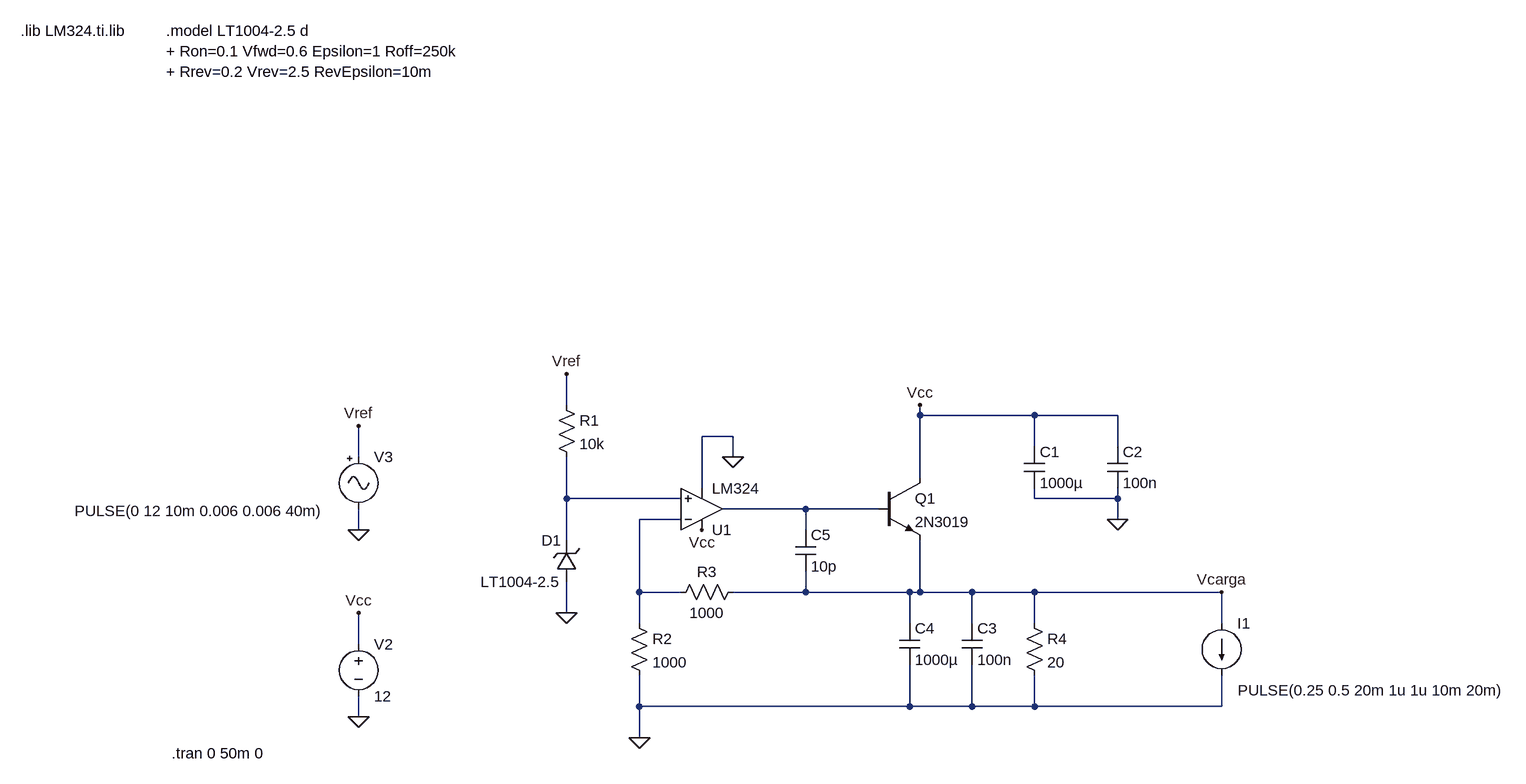
[diagram p0: schematic fuente.asc]
fuente.asc, the LTspice schematic file:
Version 4.1
SHEET 1 1676 680
WIRE 96 64 96 16
WIRE 640 80 640 64
WIRE 816 80 640 80
WIRE 944 80 816 80
WIRE 352 112 304 112
WIRE 816 128 816 80
WIRE 944 128 944 80
WIRE -224 144 -224 96
WIRE 352 144 352 112
WIRE 640 176 640 80
WIRE 304 192 304 112
WIRE 96 208 96 144
WIRE 272 208 96 208
WIRE 816 208 816 192
WIRE 944 208 944 192
WIRE 944 208 816 208
WIRE 464 224 336 224
WIRE 576 224 464 224
WIRE 272 240 208 240
WIRE 944 240 944 208
WIRE -224 256 -224 224
WIRE 464 256 464 224
WIRE 96 272 96 208
WIRE 208 352 208 240
WIRE 272 352 208 352
WIRE 464 352 464 320
WIRE 464 352 352 352
WIRE 624 352 464 352
WIRE 640 352 640 272
WIRE 640 352 624 352
WIRE 720 352 640 352
WIRE 816 352 720 352
WIRE 1104 352 816 352
WIRE 96 384 96 336
WIRE 208 400 208 352
WIRE 624 400 624 352
WIRE 720 400 720 352
WIRE 816 400 816 352
WIRE 1104 400 1104 352
WIRE -224 432 -224 384
WIRE 208 528 208 480
WIRE 624 528 624 464
WIRE 624 528 208 528
WIRE 720 528 720 464
WIRE 720 528 624 528
WIRE 816 528 816 480
WIRE 816 528 720 528
WIRE 1104 528 1104 480
WIRE 1104 528 816 528
WIRE -224 544 -224 512
WIRE 208 576 208 528
FLAG 96 384 0
FLAG 208 576 0
FLAG -224 384 Vcc
FLAG 304 256 Vcc
FLAG -224 544 0
FLAG 352 144 0
FLAG 640 64 Vcc
FLAG 96 16 Vref
FLAG -224 256 0
FLAG -224 96 Vref
FLAG 1104 352 Vcarga
FLAG 944 240 0
SYMBOL OpAmps\\opamp2 304 288 M180
SYMATTR InstName U1
SYMATTR Value LM324
SYMBOL zener 112 336 R180
WINDOW 0 24 64 Left 2
WINDOW 3 24 0 Left 2
SYMATTR InstName D1
SYMATTR Value LT1004-2.5
SYMBOL res 80 48 R0
SYMATTR InstName R1
SYMATTR Value 10k
SYMBOL npn 576 176 R0
SYMATTR InstName Q1
SYMATTR Value 2N3019
SYMBOL res 192 384 R0
SYMATTR InstName R2
SYMATTR Value 1000
SYMBOL res 368 336 R90
WINDOW 0 0 56 VBottom 2
WINDOW 3 32 56 VTop 2
SYMATTR InstName R3
SYMATTR Value 1000
SYMBOL res 800 384 R0
SYMATTR InstName R4
SYMATTR Value 20
SYMBOL voltage -224 416 R0
WINDOW 123 0 0 Left 0
WINDOW 39 0 0 Left 0
SYMATTR InstName V2
SYMATTR Value 12
SYMBOL Misc\\signal -224 128 R0
WINDOW 3 -437 99 Left 2
WINDOW 123 0 0 Left 0
WINDOW 39 0 0 Left 0
SYMATTR InstName V3
SYMATTR Value PULSE(0 12 10m 0.006 0.006 40m)
SYMBOL current 1104 400 R0
WINDOW 3 437 103 Right 2
WINDOW 123 0 0 Left 0
WINDOW 39 0 0 Left 0
SYMATTR InstName I1
SYMATTR Value PULSE(0.25 0.5 20m 1u 1u 10m 20m)
SYMBOL cap 800 128 R0
SYMATTR InstName C1
SYMATTR Value 1000µ
SYMBOL cap 928 128 R0
SYMATTR InstName C2
SYMATTR Value 100n
SYMBOL cap 704 400 R0
SYMATTR InstName C3
SYMATTR Value 100n
SYMBOL cap 608 400 R0
SYMATTR InstName C4
SYMATTR Value 1000µ
SYMBOL cap 448 256 R0
SYMATTR InstName C5
SYMATTR Value 10p
TEXT -744 -512 Left 2 !.lib LM324.ti.lib
TEXT -520 -512 Left 2 !.model LT1004-2.5 d\n+ Ron=0.1 Vfwd=0.6 Epsilon=1 Roff=250k\n+ Rrev=0.2 Vrev=2.5 RevEpsilon=10m
TEXT -512 600 Left 2 !.tran 0 50m 0

The netlist it stands for:
* fuente.asc
X§U1 N001 N003 Vcc 0 N002 LM324  ; pins In+ In- V+ V- OUT
D1 0 N001 LT1004-2.5
R1 Vref N001 10k
Q1 Vcc N002 Vcarga 0 2N3019
R2 N003 0 1000
R3 Vcarga N003 1000
R4 Vcarga 0 20
V2 Vcc 0 12
V3 Vref 0 PULSE(0 12 10m 0.006 0.006 40m)
I1 Vcarga 0 PULSE(0.25 0.5 20m 1u 1u 10m 20m)
C1 Vcc 0 1000µ
C2 Vcc 0 100n
C3 Vcarga 0 100n
C4 Vcarga 0 1000µ
C5 N002 Vcarga 10p
.model D D
.lib standard.dio
.model NPN NPN
.model PNP PNP
.lib standard.bjt
.lib LM324.ti.lib
.model LT1004-2.5 d
+ Ron=0.1 Vfwd=0.6 Epsilon=1 Roff=250k
+ Rrev=0.2 Vrev=2.5 RevEpsilon=10m
.tran 0 50m 0
.backanno
.end